# Altium schematic sheet Oscillator_32_768KHz.SchDoc: Oscillator 32.768KHz
size A4
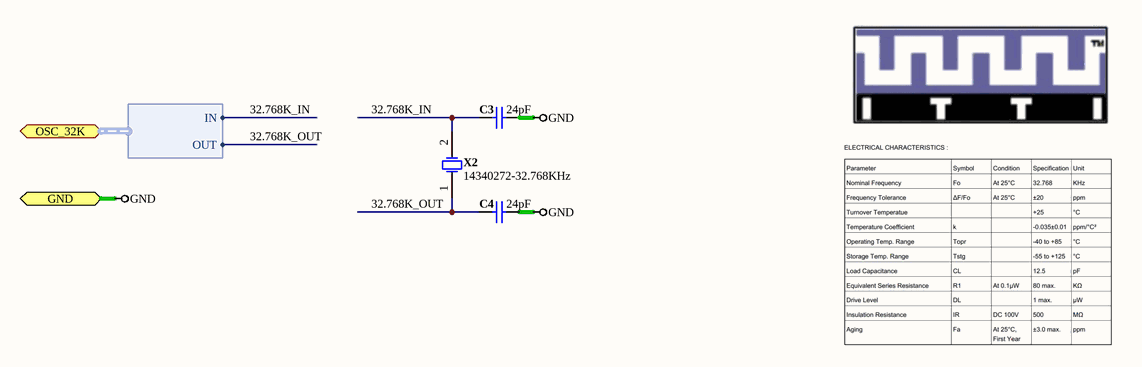
[diagram p0: Oscillator_32_768KHz.SchDoc]

## Parts
C3  value 24pF  [CAPC0402(1005)60_N]  (hidden comment: CAP 24pF 10V 0402(1005))
C4  value 24pF  [CAPC0402(1005)60_N]  (hidden comment: CAP 24pF 10V 0402(1005))
X2  14340272-32.768KHz  [ITTI-14340272-32.768KHz-2_V]

## Ports
GND, OSC_32K (harness OSC)

## Harnesses
OSC: OUT, IN

## Nets
GND: C3.1 C4.1 ; port GND
32.768K_IN: C3.2 X2.2(X2) ; port OSC_32K.IN
32.768K_OUT: C4.2 X2.1(X1) ; port OSC_32K.OUT

## Notes on the sheet
- Sheet Title
- Project Title
- Size:
- Date:
- A4
- Item:
- Time:
- Revision:
- Sheet
- of
- File:

## Library data of the parts
C3 C4 = CMP-1034-00923-1: CAP 24pF 10V ±0.25pF 0402 (1005 Metric) Thickness 0.6mm SMD; Case-Metric: 1005; Case-EIA: 0402; Rated Voltage: 10 V; Max Thickness: 0.6 mm; Tolerance: ±0.25pF; Technology: SMT
X2 = CMP-0463-00001-1: Crystal, 32.768 KHz, -40 to 85 degC, 3.2 x 1.5 x 0.9 mm SMD; Manufacturer: ITTI; Drive Level: 1 max. uw; Load Capacitance: 12.5 pF; Frequency Tolerance: +/-20 ppm; Operating Temperature: -40 to 85 degC; Mounting Technology: Surface Mount; ComponentLink1Description: Manufacturer URL; Nominal Frequency: 32.768KHz; PartNumber: 14340272-32.768KHz; PackageReference: 14340272-32.768KHz-2; ComponentLink1URL: http://www.itti-co.com; PackageDescription: 2-Pin Hand Drawn, Body 3.2 x 1.5mm, Pitch 2.5 mm